# Altium project sparkroad_extend.PrjPcb
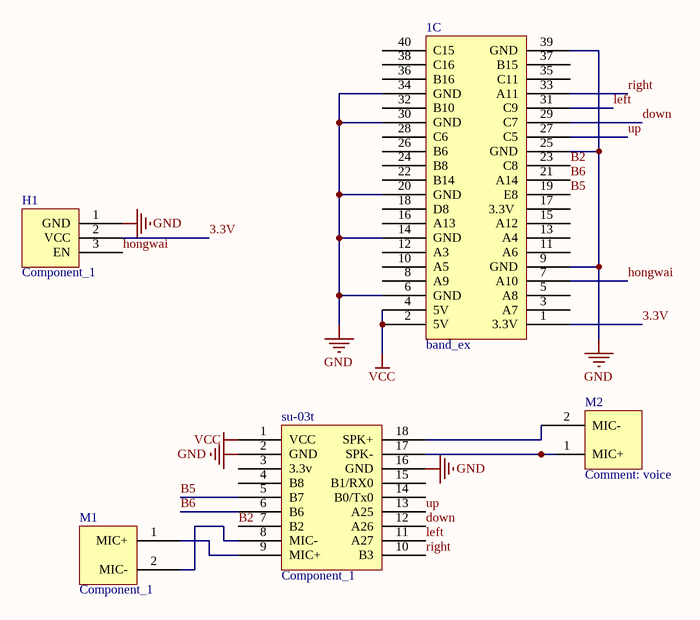
[diagram p0: sparkroad_sheet1.SchDoc]
1 sheet, 5 parts. Net scope: global (net labels, ports and power ports of the same name join across sheets).
Board file: sparkroad_PCB.PcbDoc

## Sheet sparkroad_sheet1.SchDoc
size A4

### Parts
1  band_ex  [HDR2X20]  (part C of 3)
H1  Component_1  [HDR1X3]
M1  Component_1  [PCBComponent_1]
M2  voice  [PCBComponent_1]
su-03t  Component_1  [SU-03T]

### Nets
GND: 1.6(GND) 1.9(GND) 1.14(GND) 1.20(GND) 1.25(GND) 1.30(GND) 1.34(GND) 1.39(GND) H1.1(GND) su-03t.2(GND) su-03t.16(GND)
VCC: 1.2(5V) 1.4(5V) su-03t.1(VCC)
3.3V: 1.1(3.3V) H1.2(VCC)
B2: 1.23(C8) su-03t.7(B2)
B5: 1.19(E8) su-03t.5(B7)
B6: 1.21(A14) su-03t.6(B6)
down: 1.29(C7) su-03t.12(A26)
hongwai: 1.7(A10) H1.3(EN)
left: 1.31(C9) su-03t.11(A27)
right: 1.33(A11) su-03t.10(B3)
up: 1.27(C5) su-03t.13(A25)
NetM1_1: M1.1(MIC+) su-03t.9(MIC+)
NetM1_2: M1.2(MIC-) su-03t.8(MIC-)
NetM2_1: M2.1(MIC+) su-03t.17(SPK-)
NetM2_2: M2.2(MIC-) su-03t.18(SPK+)

Not connected (* = marked no-connect by the designer): 1 3(A7) 5(A8) 8(A9) 10(A5) 11(A6) 12(A3) 13(A4) 15(A12) 16(A13) 17(3.3V_) 18(D8) 22(B14) 24(B8) 26(B6) 28(C6) 32(B10) 35(C11) 36(B16) 37(B15) 38(C16) 40(C15); su-03t 3(3.3v) 4(B8) 14(B0/Tx0) 15(B1/RX0)

### Library data of the parts
1 M2 = Component_1